# EAGLE design doorlocks (EAGLE 5.10)
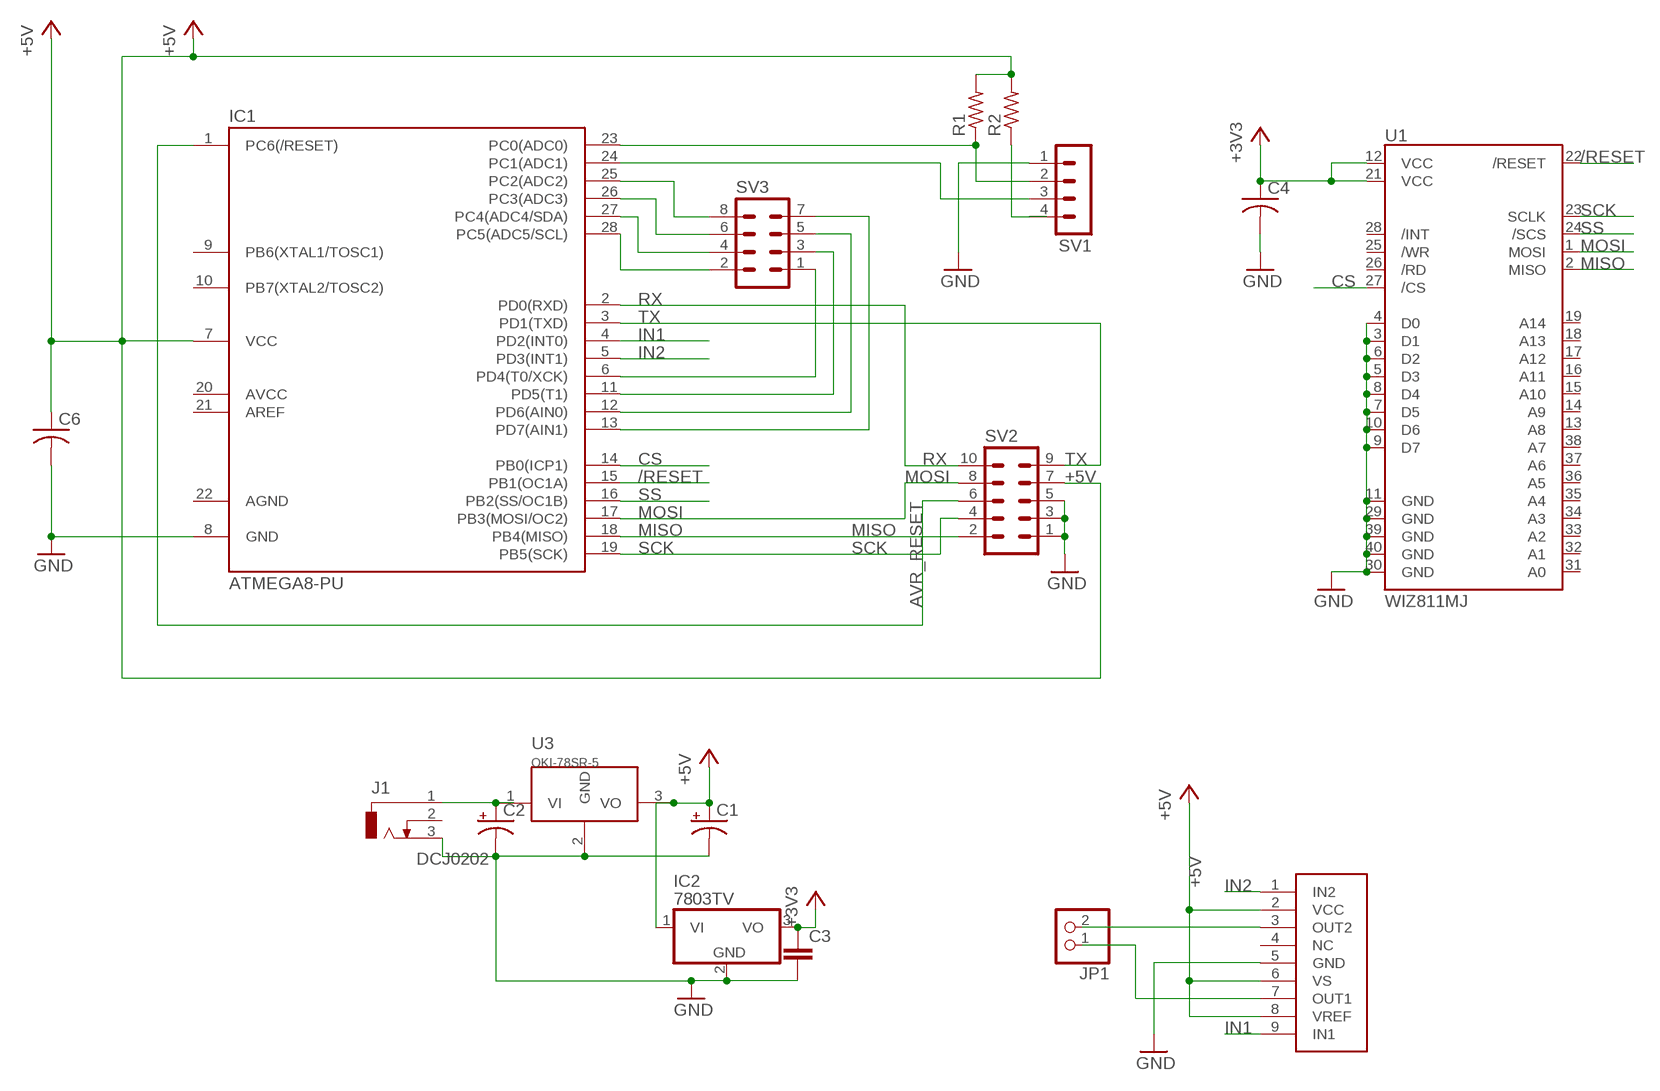
[diagram p0: schematic, sheet 1]

## Parts
C1  CPOL-USE3.5-8  [E3,5-8]
C2  CPOL-USE3.5-8  [E3,5-8]
C3  C2.5/5  [C2.5-5]
C4  C-USC0805  [C0805]
C6  C-USC0805  [C0805]
IC1  ATMEGA8-PU  [DIL28-3]
IC2  7803TV  7805TV  [TO220V]
J1  DCJ0202  DCJ0202  [DCJ0202]
JP1  PINHD-1X2  [1X02]
R1  R-US_R0805  [R0805]
R2  R-US_R0805  [R0805]
SV1  MA04-1  [MA04-1]
SV2  MA05-2  [MA05-2]
SV3  MA04-2  [MA04-2]
U1  WIZ811MJ  [WIZ811MJ]
U3  OKI-78SR-5  [TO220V]
U$1  TA7291  [SIP9]

## Nets
+3V3: C3.1 C4.1 IC2.3(VO) U1.12(VCC) U1.21(VCC)
+5V: C1.+ C6.1 IC1.7(VCC) IC2.1(VI) R1.2 R2.2 SV2.7 U3.3(VO) U$1.2(VCC) U$1.6(VS) U$1.8(VREF)
/RESET: IC1.15(PB1(OC1A)) U1.22(/RESET)
AVR_RESET: IC1.1(PC6(/RESET)) SV2.6
CS: IC1.14(PB0(ICP1)) U1.27(/CS)
GND: C1.- C2.- C3.2 C4.2 C6.2 IC1.8(GND) IC2.2(GND) J1.3 SV1.1 SV2.1 SV2.3 SV2.5 U1.3(D1) U1.4(D0) U1.5(D3) U1.6(D2) U1.7(D5) U1.8(D4) U1.9(D7) U1.10(D6) U1.11(GND) U1.29(GND) U1.30(GND) U1.39(GND) U1.40(GND) U3.2(GND) U$1.5(GND)
IN1: IC1.4(PD2(INT0)) U$1.9(IN1)
IN2: IC1.5(PD3(INT1)) U$1.1(IN2)
MISO: IC1.18(PB4(MISO)) SV2.2 U1.2(MISO)
MOSI: IC1.17(PB3(MOSI/OC2)) SV2.8 U1.1(MOSI)
N$1: IC1.24(PC1(ADC1)) SV1.3
N$5: IC1.27(PC4(ADC4/SDA)) SV3.4
N$6: IC1.23(PC0(ADC0)) R1.1 SV1.2
N$7: IC1.26(PC3(ADC3)) SV3.6
N$8: R2.1 SV1.4
N$9: IC1.25(PC2(ADC2)) SV3.8
N$10: IC1.6(PD4(T0/XCK)) SV3.1
N$11: IC1.11(PD5(T1)) SV3.3
N$12: IC1.12(PD6(AIN0)) SV3.5
N$13: IC1.13(PD7(AIN1)) SV3.7
N$14: C2.+ J1.1 U3.1(VI)
OUT1: JP1.1 U$1.7(OUT1)
OUT2: JP1.2 U$1.3(OUT2)
PC5: IC1.28(PC5(ADC5/SCL)) SV3.2
RX: IC1.2(PD0(RXD)) SV2.10
SCK: IC1.19(PB5(SCK)) SV2.4 U1.23(SCLK)
SS: IC1.16(PB2(SS/OC1B)) U1.24(/SCS)
TX: IC1.3(PD1(TXD)) SV2.9
Unconnected: IC1.9(PB6(XTAL1/TOSC1)) IC1.10(PB7(XTAL2/TOSC2)) IC1.20(AVCC) IC1.21(AREF) J1.2 U1.13(A8) U1.14(A9) U1.15(A10) U1.16(A11) U1.17(A12) U1.18(A13) U1.19(A14) U1.25(/WR) U1.26(/RD) U1.28(/INT) U1.31(A0) U1.32(A1) U1.33(A2) U1.34(A3) U1.35(A4) U1.36(A5) U1.37(A6) U1.38(A7) U$1.4(NC)

## Power pins joined to a net without a drawn wire
AGND: IC1.22(AGND)

## Library data of the parts
C1 C2 = resistor:CPOL-US: POLARIZED CAPACITOR, American symbol
C3 = capacitor-wima:C: CAPACITOR naming: grid - package width
C4 C6 = rcl:C-US: CAPACITOR, American symbol
IC1 = atmega8:ATMEGA8-PU
IC2 = linear:78*: Positive VOLTAGE REGULATOR Source: http://cache.national.com/ds/LM/LM78L05.pdf http://www.fairchildsemi.com/ds/LM/LM7805.pdf
J1 = con-jack:DCJ0202: DC POWER JACK Source: DCJ0202.pdf
JP1 = pinhead:PINHD-1X2: PIN HEADER
R1 R2 = rcl:R-US_: RESISTOR, American symbol
SV1 = con-lstb:MA04-1: PIN HEADER
SV2 = con-lstb:MA05-2: PIN HEADER
SV3 = con-lstb:MA04-2: PIN HEADER
U1 = SparkFun:WIZ811MJ: WIZnet W5100 Network Module with MagJack - WIZ811MJ WIZnet's WIZ811MJ is a breakout board for the W5100 embedded TCP/IP chip. Also included on the board is a RJ-45 MagJack Connector (RJ45 with X'FMR). See http://www.sparkfun.com/commerce/product_info.php?products_id=9473 for more documentation and info. **UNPROVEN
U3 = addedParts:OKI-78SR-5: CONV DC/DC 7.5W 36VIN 5VOUT
U$1 = TA7291SG:TA7291

## Board
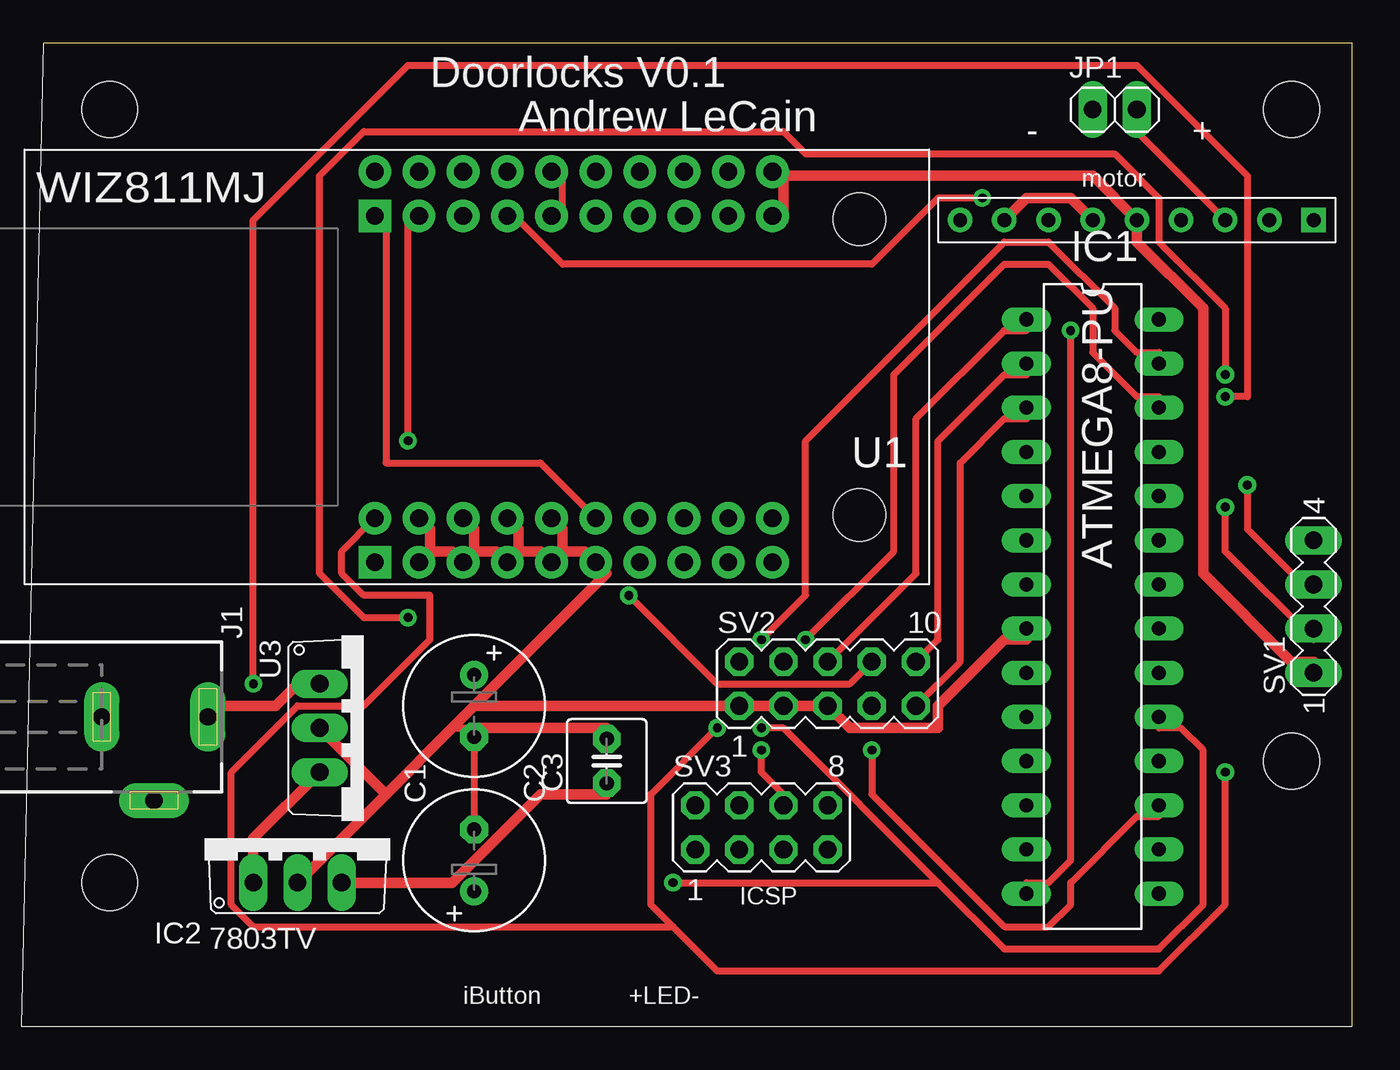
[diagram p1: board, top side]
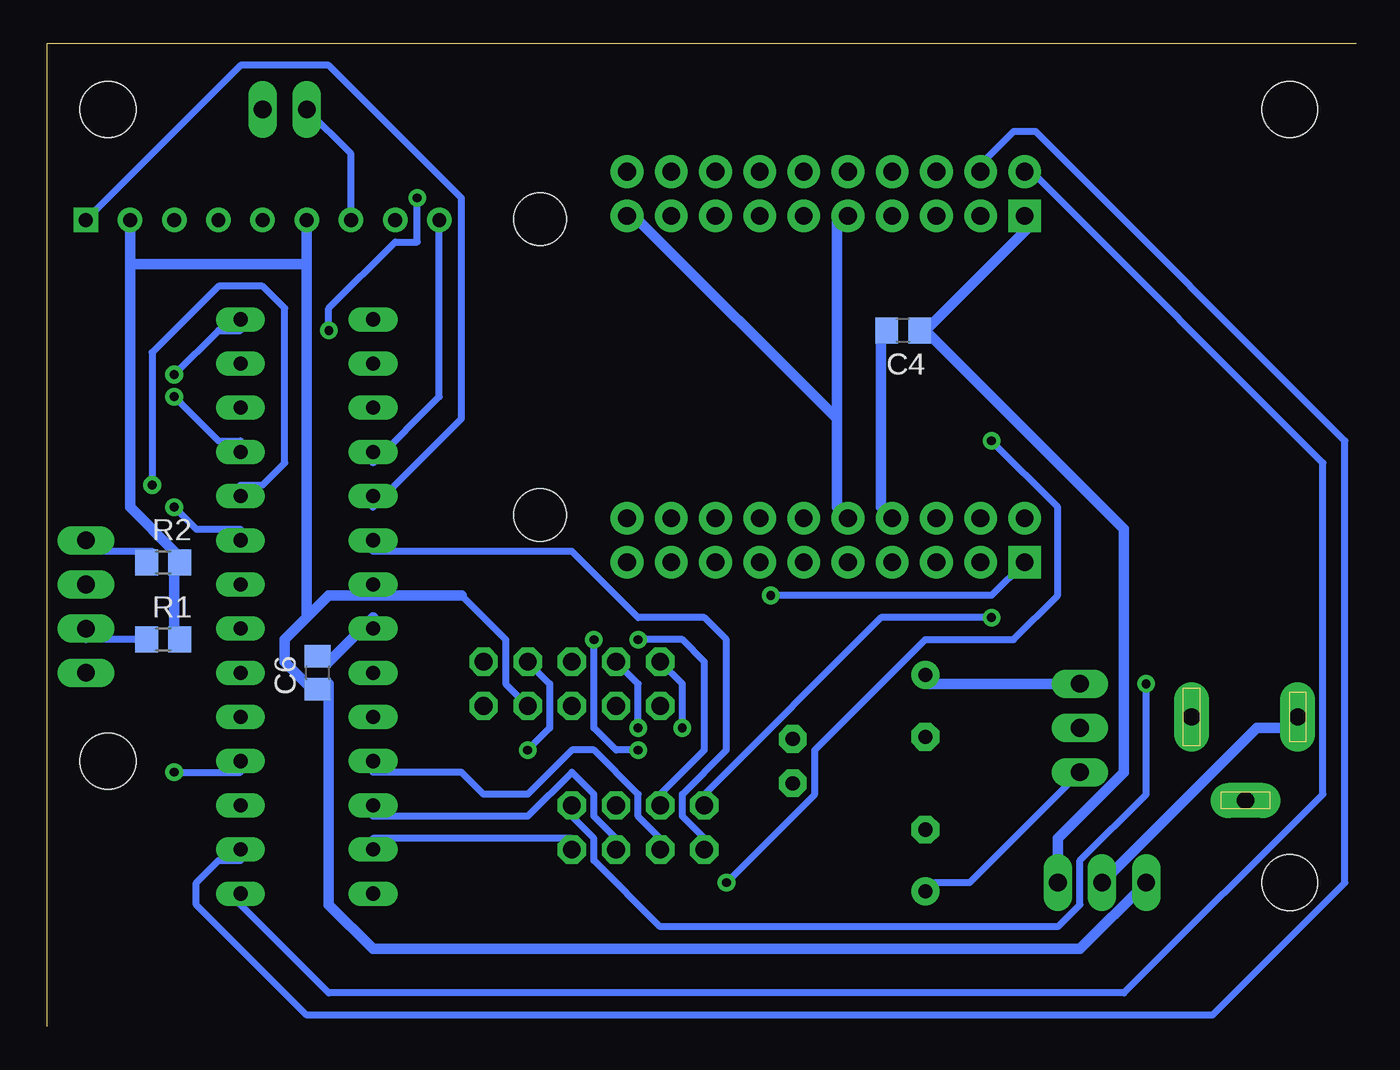
[diagram p2: board, bottom side, seen from below]

Size 75.23 x 56.51 mm. Coordinates in mm from the lower left corner, seen from the top.
Outline: 75.23,0 75.23,56.51 0,56.51
Copper layers (1*16): Top 0.035mm / dielectric 1.5mm / Bottom 0.035mm
Design rules "SparkFun *": minimum track width 16mil, minimum drill 20mil, track to track 8mil, track to pad 8mil, pad to pad 8mil, via to via 8mil, smd to smd 8mil, copper to edge 10mil, drill to drill 8mil, minimum pad ring 12mil, minimum via ring 10mil, stop-mask expansion 4mil, vias tented up to drill 25mil, thermal gap 10mil
Holes 3.2 mm at 71.75,15.24 71.75,52.7 3.81,8.26 3.81,52.7

### Footprints (pad centres in the part's own frame; a part is rotated, then mirrored left to right if it is on the bottom)
E3,5-8 = drill 0.813 pad 1.6 round: + -1.778,0 | drill 0.813 pad 1.6 octagon: - 1.778,0
C2.5-5 = drill 0.813 pad 1.6 octagon: 1 -1.27,0; 2 1.27,0
C0805 = smd 1.3 x 1.5: 1 -0.95,0; 2 0.95,0
DIL28-3 = drill 0.813 long: 1 -16.51,-3.81; 2 -13.97,-3.81; 3 -11.43,-3.81; 4 -8.89,-3.81; 5 -6.35,-3.81; 6 -3.81,-3.81; 7 -1.27,-3.81; 8 1.27,-3.81; 9 3.81,-3.81; 10 6.35,-3.81; 11 8.89,-3.81; 12 11.43,-3.81; 13 13.97,-3.81; 14 16.51,-3.81; 15 16.51,3.81; 16 13.97,3.81; 17 11.43,3.81; 18 8.89,3.81; 19 6.35,3.81; 20 3.81,3.81; 21 1.27,3.81; 22 -1.27,3.81; 23 -3.81,3.81; 24 -6.35,3.81; 25 -8.89,3.81; 26 -11.43,3.81; 27 -13.97,3.81; 28 -16.51,3.81
TO220V = drill 1.016 long: 1 -2.54,-2.54; 2 0,-2.54; 3 2.54,-2.54
DCJ0202 = drill 1 pad 2 long: 1 0,3.1; 2 4.8,0; 3 0,-3
1X02 = drill 1.016 long: 1 -1.27,0; 2 1.27,0
R0805 = smd 1.3 x 1.5: 1 -0.95,0; 2 0.95,0
MA04-1 = drill 1.016 long: 1 -3.81,0; 2 -1.27,0; 3 1.27,0; 4 3.81,0
MA05-2 = drill 1.016 octagon: 1 -5.08,-1.27; 2 -5.08,1.27; 3 -2.54,-1.27; 4 -2.54,1.27; 5 0,-1.27; 6 0,1.27; 7 2.54,-1.27; 8 2.54,1.27; 9 5.08,-1.27; 10 5.08,1.27
MA04-2 = drill 1.016 octagon: 1 -3.81,-1.27; 2 -3.81,1.27; 3 -1.27,-1.27; 4 -1.27,1.27; 5 1.27,-1.27; 6 1.27,1.27; 7 3.81,-1.27; 8 3.81,1.27
WIZ811MJ = drill 1.02 pad 1.88 square: 1 0,0; 21 0,-19.92 | drill 1.02 pad 1.88 round: 2 0,-2.54; 3 -2.54,0; 4 -2.54,-2.54; 5 -5.08,0; 6 -5.08,-2.54; 7 -7.62,0; 8 -7.62,-2.54; 9 -10.16,0; 10 -10.16,-2.54; 11 -12.7,0; 12 -12.7,-2.54; 13 -15.24,0; 14 -15.24,-2.54; 15 -17.78,0; 16 -17.78,-2.54; 17 -20.32,0; 18 -20.32,-2.54; 19 -22.86,0; 20 -22.86,-2.54; 22 0,-22.46; 23 -2.54,-19.92; 24 -2.54,-22.46; 25 -5.08,-19.92; 26 -5.08,-22.46; 27 -7.62,-19.92; 28 -7.62,-22.46; 29 -10.16,-19.92; 30 -10.16,-22.46; 31 -12.7,-19.92; 32 -12.7,-22.46; 33 -15.24,-19.92; 34 -15.24,-22.46; 35 -17.78,-19.92; 36 -17.78,-22.46; 37 -20.32,-19.92; 38 -20.32,-22.46; 39 -22.86,-19.92; 40 -22.86,-22.46 | hole 3: -27.86,-19.73; -27.86,-2.73
TO220V' = drill 1.016 long: 1 -2.54,0; 2 0,0; 3 2.54,0
SIP9 = drill 0.8 square: 1 0,10.16 | drill 0.8 round: 2 0,7.62; 3 0,5.08; 4 0,2.54; 5 0,0; 6 0,-2.54; 7 0,-5.08; 8 0,-7.62; 9 0,-10.16

### Placement (x,y rotation side)
C1  24.77,9.53 90 top
C2  24.77,18.41 270 top
C3  32.38,15.24 90 top
C4  26.04,40.01 180 bottom
C6  59.69,20.32 90 bottom
IC1  60.33,24.13 270 top
IC2  14.6,10.79 0 top
J1  6.35,17.78 270 top
JP1  61.59,52.7 0 top
R1  68.58,22.23 0 bottom
R2  68.58,26.67 0 bottom
SV1  73.03,24.13 90 top
SV2  45.09,19.69 0 top
SV3  41.27,11.43 0 top
U1  19.05,26.67 180 top
U3  OKI-78SR-5  [TO220V']  15.88,17.14 270 top
U$1  62.87,46.35 270 top

### Tracks (layer width: path | path; a pad name or v marks a point on that pad's centre or on a via)
+3V3
  Top 0.406: 32.38,13.34 C3.1 | U1.12 28.58,32.39 19.69,32.39 19.69,46.35 U1.21
  Top 0.61: 32.38,13.34 28.58,13.34 23.5,8.26 IC2.3
  Bottom 0.406: 24.77,40.01 C4.1
  Bottom 0.61: U1.21 18.42,46.35 24.77,40.01 13.33,28.57 13.33,14.61 17.14,10.79 IC2.3
+5V
  Top 0.61: IC2.1 12.06,10.79 U3.3 | U$1.8 56.52,47.62 59.05,47.62 U$1.6
  Bottom 0.406: 67.95,22.23 R1.2 | 67.95,26.04 R2.2 67.95,27.3 | U3.3 22.23,8.26 24.77,8.26 C1.+ | 60.33,19.69 C6.1 59.05,19.69 | SV2.7 48.9,19.69 48.9,22.23 51.44,24.77
  Bottom 0.61: 67.95,26.04 67.95,22.23 | 70.48,43.81 70.48,29.84 67.95,27.3 | 70.48,43.81 U$1.2 | 60.33,19.69 61.59,20.96 61.59,22.23 60.33,23.5 | 60.33,23.5 59.05,24.77 56.52,24.77 | 56.52,24.77 51.44,24.77 | 56.52,24.77 IC1.7 | 60.33,23.5 60.33,43.81 | 60.33,43.81 U$1.6 | IC2.1 15.88,4.45 56.52,4.45 59.05,6.99 59.05,19.69 | 60.33,43.81 70.48,43.81
/RESET
  Bottom 0.406: IC1.15 64.13,6.99 59.05,1.91 13.33,1.91 1.91,13.34 1.91,32.39 18.42,48.9 U1.22
AVR_RESET
  Top 0.406: SV2.6 50.16,26.04 50.16,34.92 55.25,40.01 56.52,40.01 IC1.1
CS  (via drill 0.51)
  Top 0.406: v59.05,40.01 59.05,9.53 57.79,8.26 56.52,8.26 IC1.14 | v53.98,47.62 51.44,47.62 47.62,43.81 29.85,43.81 27.3,46.35 U1.27
  Bottom 0.406: v59.05,40.01 59.05,41.27 55.25,45.09 53.98,45.09 v53.98,47.62
GND
  Top 0.406: U1.5 23.5,27.3 | U1.7 26.04,27.3 | C1.- C2.- 24.77,17.14 23.5,17.14 | U1.29 29.85,46.35 29.85,48.9 U1.30 | 29.85,28.57 U1.10
  Top 0.61: 42.55,48.9 60.33,48.9 U$1.5 62.87,45.09 66.67,41.27 66.67,26.04 71.75,20.96 73.03,20.96 SV1.1 | 42.55,48.9 42.55,46.35 U1.39 | 42.55,48.9 U1.40 | IC1.8 56.52,22.23 55.25,22.23 51.44,18.41 51.44,17.14 46.36,17.14 SV2.5 SV2.3 SV2.1 24.77,18.41 | 22.23,27.3 22.23,28.57 U1.4 | 24.77,27.3 24.77,28.57 U1.6 | 23.5,27.3 22.23,27.3 | 22.23,27.3 U1.3 | 27.3,27.3 27.3,28.57 U1.8 | 26.04,27.3 24.77,27.3 | 24.77,27.3 U1.5 | 24.77,17.14 32.38,17.14 C3.2 | 29.85,27.3 29.85,28.57 | 24.77,18.41 32.38,26.04 U1.11 31.12,27.3 29.85,27.3 | 24.77,18.41 23.5,17.14 19.69,13.34 | IC2.2 19.69,13.34 | 19.69,13.34 U3.2 | 29.85,27.3 U1.9 28.58,27.3 27.3,27.3 | 27.3,27.3 U1.7
  Bottom 0.406: 59.05,20.96 C6.2 | 27.3,40.01 C4.2 | J1.3 3.17,17.14 | 29.85,46.35 U1.29 | 41.27,46.35 U1.39
  Bottom 0.61: 59.05,20.96 56.52,23.5 IC1.8 | 27.3,40.01 27.3,29.84 U1.8 | 3.17,17.14 5.71,17.14 IC2.2 | 29.85,34.92 29.85,29.84 U1.10 | 29.85,34.92 29.85,46.35 | 29.85,34.92 41.27,46.35
IN1
  Bottom 0.406: U$1.9 52.7,36.2 56.52,32.39 IC1.4
IN2
  Bottom 0.406: U$1.1 64.13,55.24 59.05,55.24 51.44,47.62 51.44,34.92 56.52,29.84 IC1.5
MISO  (via drill 0.51)
  Top 0.406: v67.95,14.61 67.95,6.99 64.13,3.18 38.73,3.18 36.2,5.71 | 36.2,5.71 34.93,6.99 34.93,13.34 v38.73,17.14 | 36.2,5.71 12.06,5.71 10.79,6.99 10.79,14.61 14.6,18.41 18.42,18.41 22.23,22.23 22.23,24.77 18.42,24.77 17.14,26.04 17.14,27.3 U1.2
  Bottom 0.406: v67.95,14.61 64.13,14.61 IC1.18 | v38.73,17.14 38.73,19.69 SV2.2
MOSI  (via drill 0.51)
  Top 0.406: v47.62,15.88 47.62,13.34 55.25,5.71 57.79,5.71 59.05,6.99 59.05,8.26 62.87,12.07 64.13,12.07 IC1.17 | v33.66,24.77 38.73,19.69 46.36,19.69 SV2.8
  Bottom 0.406: v47.62,15.88 46.36,17.14 46.36,19.69 SV2.8 | v33.66,24.77 20.96,24.77 U1.1
N$1  (via drill 0.51)
  Top 0.406: v69.22,31.12 69.22,28.57 73.03,24.77 SV1.3
  Bottom 0.406: v69.22,31.12 69.22,38.73 65.41,42.55 62.87,42.55 61.59,41.27 61.59,32.39 62.87,31.12 64.13,31.12 IC1.24
N$5  (via drill 0.51)
  Top 0.406: v41.27,22.23 43.81,24.77 43.81,33.66 55.25,45.09 57.79,45.09 61.59,41.27 61.59,40.01 62.87,38.73 64.13,38.73 IC1.27
  Bottom 0.406: v41.27,22.23 38.73,22.23 37.47,20.96 37.47,15.88 40.01,13.34 SV3.4
N$6  (via drill 0.51)
  Top 0.406: v67.95,29.84 67.95,27.3 73.03,22.23 SV1.2
  Bottom 0.406: 69.22,22.23 R1.1 73.03,22.23 SV1.2 | v67.95,29.84 66.67,28.57 64.13,28.57 IC1.23
N$7  (via drill 0.51)
  Top 0.406: v43.81,22.23 48.9,27.3 48.9,37.47 55.25,43.81 57.79,43.81 60.33,41.27 60.33,38.73 62.87,36.2 64.13,36.2 IC1.26 | v41.27,15.88 41.27,14.61 42.55,13.34 SV3.6
  Bottom 0.406: v43.81,22.23 43.81,17.14 42.55,15.88 v41.27,15.88
N$8
  Bottom 0.406: R2.1 69.22,27.3 73.03,27.3 SV1.4
N$9  (via drill 0.51)
  Top 0.406: v67.95,36.2 69.22,36.2 69.22,48.9 62.87,55.24 20.96,55.24 12.06,46.35 v12.06,19.69
  Bottom 0.406: v67.95,36.2 65.41,33.66 64.13,33.66 IC1.25 | v12.06,19.69 12.06,13.34 15.88,9.53 15.88,6.99 17.14,5.71 40.01,5.71 43.81,9.53 43.81,10.79 45.09,12.07 SV3.8
N$10
  Bottom 0.406: IC1.6 56.52,27.3 45.09,27.3 41.27,23.5 37.47,23.5 36.2,22.23 36.2,15.88 38.73,13.34 38.73,12.07 37.47,10.79 SV3.1
N$11
  Bottom 0.406: IC1.11 56.52,14.61 51.44,14.61 50.16,13.34 47.62,13.34 45.09,15.88 43.81,15.88 41.27,13.34 41.27,12.07 40.01,10.79 SV3.3
N$12
  Bottom 0.406: IC1.12 56.52,12.07 47.62,12.07 45.09,14.61 43.81,13.34 43.81,12.07 42.55,10.79 SV3.5
N$13
  Bottom 0.406: IC1.13 56.52,10.79 45.09,10.79 SV3.7
N$14
  Top 0.61: U3.1 14.6,19.69 13.33,18.41 9.53,18.41 J1.1
  Bottom 0.61: U3.1 24.77,19.69 C2.+
OUT1
  Bottom 0.406: U$1.7 57.79,50.16 JP1.1
OUT2
  Top 0.406: U$1.3 62.87,51.44 JP1.2
PC5  (via drill 0.51)
  Top 0.406: v67.95,37.47 67.95,41.27 64.13,45.09 64.13,47.62 61.59,50.16 43.81,50.16 42.55,51.44 18.42,51.44 15.88,48.9 15.88,26.04 18.42,23.5 v20.96,23.5
  Bottom 0.406: v67.95,37.47 65.41,40.01 64.13,40.01 IC1.28 | v20.96,23.5 27.3,23.5 37.47,13.34 SV3.2
RX
  Top 0.406: SV2.10 51.44,22.23 51.44,33.66 55.25,37.47 56.52,37.47 IC1.2
SCK  (via drill 0.51)
  Top 0.406: 51.44,8.26 42.55,17.14 v41.27,17.14 | 51.44,8.26 55.25,4.45 64.13,4.45 66.67,6.99 66.67,15.88 65.41,17.14 64.13,17.14 IC1.19 | v20.96,33.66 20.96,46.35 U1.23 | v36.2,8.26 51.44,8.26
  Bottom 0.406: v41.27,17.14 41.27,19.69 SV2.4 | v20.96,33.66 17.14,29.84 17.14,24.77 19.69,22.23 24.77,22.23 31.12,15.88 31.12,13.34 v36.2,8.26
SS
  Bottom 0.406: IC1.16 64.13,9.53 65.41,9.53 66.67,8.26 66.67,6.99 60.33,0.64 8.25,0.64 0.64,8.26 0.64,33.66 18.42,51.44 19.69,51.44 22.23,48.9 U1.24
TX
  Top 0.406: SV2.9 52.7,20.96 52.7,32.39 55.25,34.92 56.52,34.92 IC1.3

### Text on the board
tPlace: Doorlocks V0.1 | Andrew LeCain | - | + | motor | ICSP | iButton | +LED-